# Altium schematic sheet Sensor Panel Schem.SchDoc
size A4
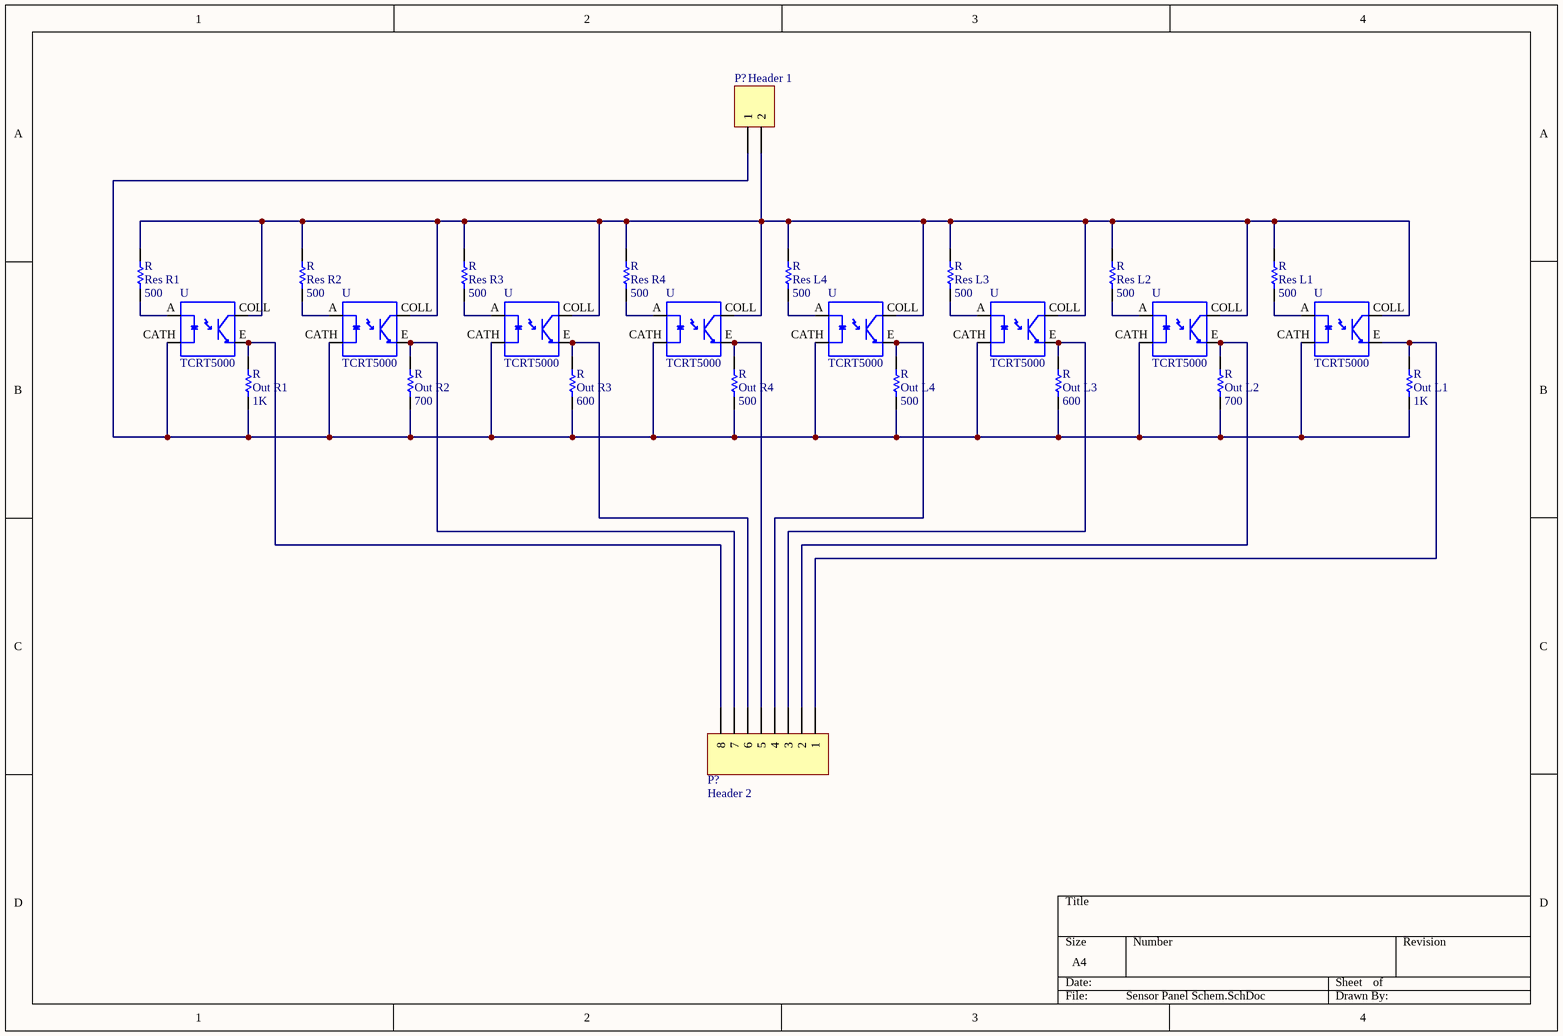
[diagram p0: Sensor Panel Schem.SchDoc]

## Parts
(Parts that share a designator on the sheet are numbered #1, #2 ... from top to bottom, then left to right.)
P?#1  Header 1  [HDR1X2]
P?#2  Header 2  [HDR1X8]
R#1  Res R1  value 500  [AXIAL-0.3]
R#2  Res R2  value 500  [AXIAL-0.3]
R#3  Res R3  value 500  [AXIAL-0.3]
R#4  Res R4  value 500  [AXIAL-0.3]
R#5  Res L4  value 500  [AXIAL-0.3]
R#6  Res L3  value 500  [AXIAL-0.3]
R#7  Res L2  value 500  [AXIAL-0.3]
R#8  Res L1  value 500  [AXIAL-0.3]
R#9  Out R1  value 1K  [AXIAL-0.3]
R#10  Out R2  value 700  [AXIAL-0.3]
R#11  Out R3  value 600  [AXIAL-0.3]
R#12  Out R4  value 500  [AXIAL-0.3]
R#13  Out L4  value 500  [AXIAL-0.3]
R#14  Out L3  value 600  [AXIAL-0.3]
R#15  Out L2  value 700  [AXIAL-0.3]
R#16  Out L1  value 1K  [AXIAL-0.3]
U#1  TCRT5000  [OPTO_TCRT5000]
U#2  TCRT5000  [OPTO_TCRT5000]
U#3  TCRT5000  [OPTO_TCRT5000]
U#4  TCRT5000  [OPTO_TCRT5000]
U#5  TCRT5000  [OPTO_TCRT5000]
U#6  TCRT5000  [OPTO_TCRT5000]
U#7  TCRT5000  [OPTO_TCRT5000]
U#8  TCRT5000  [OPTO_TCRT5000]

## Nets
NetP?#1_1: P?#1.1 R#9.1 R#10.1 R#11.1 R#12.1 R#13.1 R#14.1 R#15.1 R#16.1 U#1.CATH U#2.CATH U#3.CATH U#4.CATH U#5.CATH U#6.CATH U#7.CATH U#8.CATH
NetP?#1_2: P?#1.2 R#1.2 R#2.2 R#3.2 R#4.2 R#5.2 R#6.2 R#7.2 R#8.2 U#1.COLL U#2.COLL U#3.COLL U#4.COLL U#5.COLL U#6.COLL U#7.COLL U#8.COLL
NetP?#2_1: P?#2.1 R#16.2 U#8.E
NetP?#2_2: P?#2.2 R#15.2 U#7.E
NetP?#2_3: P?#2.3 R#14.2 U#6.E
NetP?#2_4: P?#2.4 R#13.2 U#5.E
NetP?#2_5: P?#2.5 R#12.2 U#4.E
NetP?#2_6: P?#2.6 R#11.2 U#3.E
NetP?#2_7: P?#2.7 R#10.2 U#2.E
NetP?#2_8: P?#2.8 R#9.2 U#1.E
NetR#1_1: R#1.1 U#1.A
NetR#2_1: R#2.1 U#2.A
NetR#3_1: R#3.1 U#3.A
NetR#4_1: R#4.1 U#4.A
NetR#5_1: R#5.1 U#5.A
NetR#6_1: R#6.1 U#6.A
NetR#7_1: R#7.1 U#7.A
NetR#8_1: R#8.1 U#8.A

## Library data of the parts
P?#1 = Header 2: Header, 2-Pin; LatestRevisionDate: 17-Jul-2002; LatestRevisionNote: Re-released for DXP Platform.; Publisher: Altium Limited
P?#2 = Header 8: Header, 8-Pin; LatestRevisionDate: 17-Jul-2002; LatestRevisionNote: Re-released for DXP Platform.; Publisher: Altium Limited
R#1-R#16 = Res1: Resistor; Published: 8-Jun-2000; LatestRevisionDate: 17-Jul-2002; LatestRevisionNote: Re-released for DXP Platform.; PackageReference: AXIAL-0.3; Publisher: Altium Limited; PackageDescription: Axial Device, Thru-Hole; 2 Leads; 0.3 in Pin Spacing
U#1-U#8 = TCRT5000: Reflective Optical Sensor 0.591 _15mm_ PCB Mount; MF: Vishay; Package: PCB Mount Vishay; Value: *; Price: None; MP: TCRT5000; SnapEDA_Link: https://www.snapeda.com/parts/TCRT5000/Vishay%20Semiconductor%20Opto%20Division/view-part/885229/?ref=snap; Availability: Unavailable